# Altium schematic sheet 03.Sensing.SchDoc: ARES_R30_Power
size A4; CompanyName: HIGEN; DrawnBy: 212084; Revision: V0.21; SheetNumber: 3; SheetTotal: 5; DrawingNumber: 임시도면
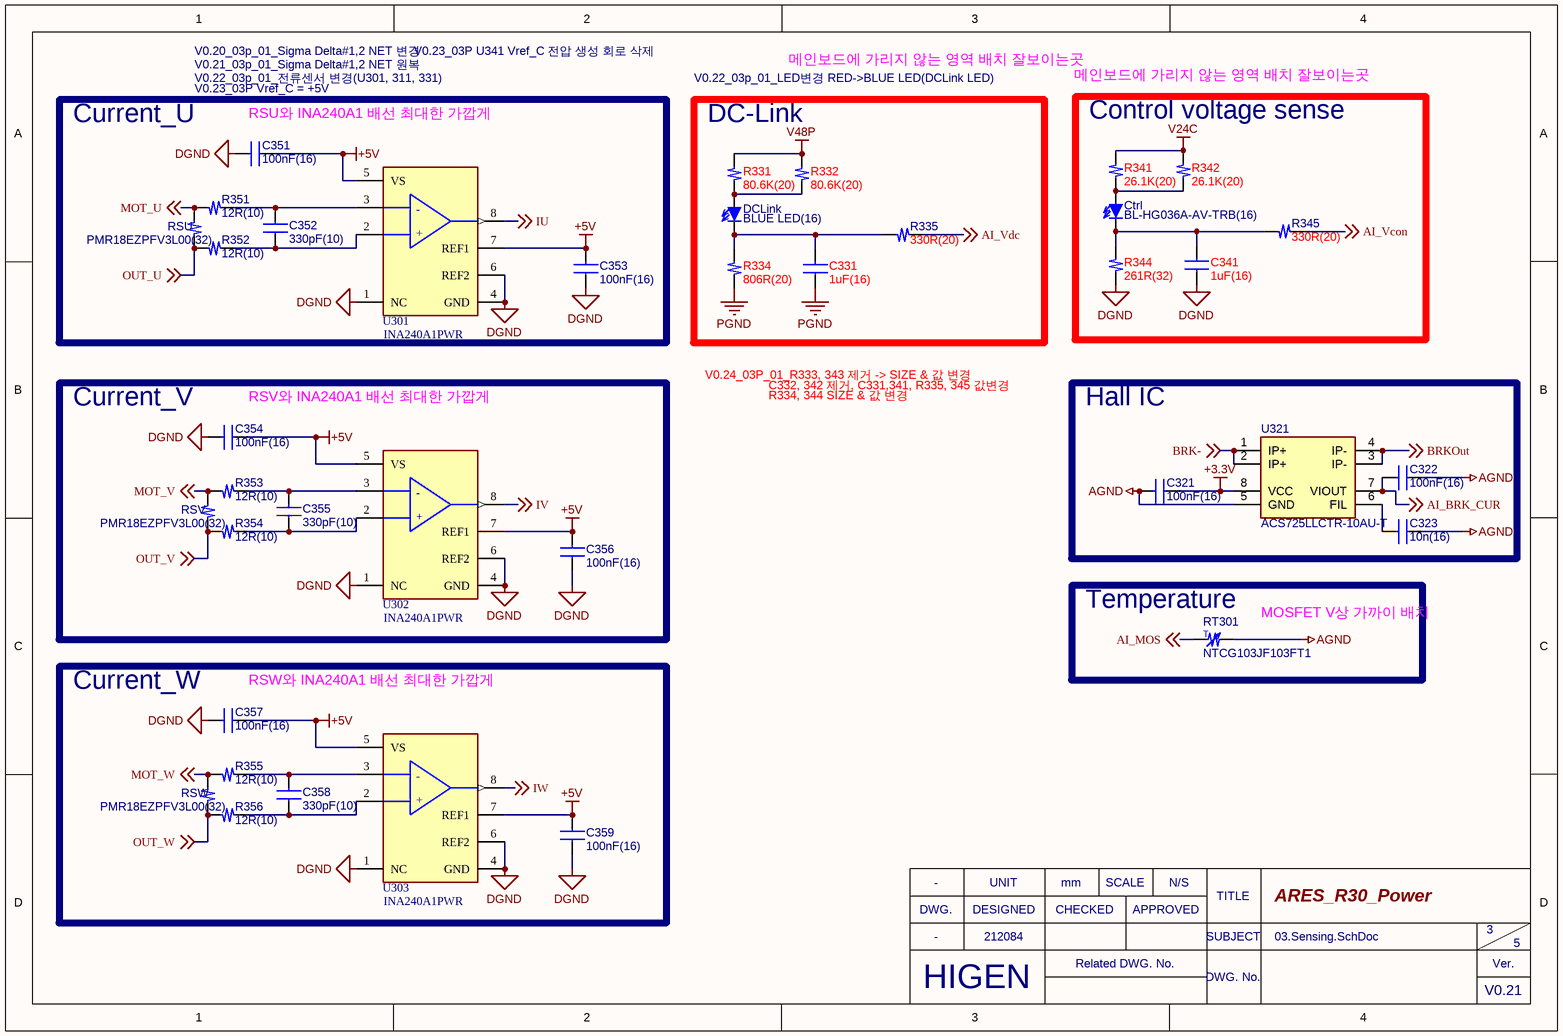
[diagram p0: 03.Sensing.SchDoc]

## Parts
C321  100nF(16)  [C-1608S]
C322  100nF(16)  [C-1608S]
C323  10n(16)  [C-1608S]
C331  1uF(16)  [C-1608S]
C341  1uF(16)  [C-1608S]
C351  100nF(16)  [C-1608S]
C352  330pF(10)  [C-1005S]
C353  100nF(16)  [C-1608]
C354  100nF(16)  [C-1608S]
C355  330pF(10)  [C-1005S]
C356  100nF(16)  [C-1608]
C357  100nF(16)  [C-1608S]
C358  330pF(10)  [C-1005S]
C359  100nF(16)  [C-1608]
Ctrl  BL-HG036A-AV-TRB(16)  [LED-1608-G]
DCLink  BLUE LED(16)  [LED-1608-B]
R331  80.6K(20)  [RES-2012]
R332  80.6K(20)  [RES-2012]
R334  806R(20)  [RES-2012]
R335  330R(20)  [RES-2012]
R341  26.1K(20)  [RES-2012]
R342  26.1K(20)  [RES-2012]
R344  261R(32)  [R-3216S]
R345  330R(20)  [RES-2012]
R351  12R(10)  [R-1005S]
R352  12R(10)  [R-1005S]
R353  12R(10)  [R-1005S]
R354  12R(10)  [R-1005S]
R355  12R(10)  [R-1005S]
R356  12R(10)  [R-1005S]
RSU  PMR18EZPFV3L00(32)  [R-5025]
RSV  PMR18EZPFV3L00(32)  [R-5025]
RSW  PMR18EZPFV3L00(32)  [R-5025]
RT301  NTCG103JF103FT1  [L-1005]
U301  INA240A1PWR  [TSSOP-8]
U302  INA240A1PWR  [TSSOP-8]
U303  INA240A1PWR  [TSSOP-8]
U321  ACS725LLCTR-10AU-T  [SO-8]

## Blocks framed on the sheet
Current_U: C351-C353 R351 R352 RSU U301
DC-Link: C331 DCLink R331 R332 R334 R335
Control voltage sense: C341 Ctrl R341 R342 R344 R345
Current_V: C354-C356 R353 R354 RSV U302
Hall IC: C321-C323 U321
Temperature: RT301
Current_W: C357-C359 R355 R356 RSW U303

## Nets
+3.3V: C321.2 U321.8(VCC)
+5V: C351.1 C353.1 C354.1 C356.1 C357.1 C359.1 U301.5(VS) U301.7(REF1) U302.5(VS) U302.7(REF1) U303.5(VS) U303.7(REF1)
AGND: C321.1 C322.2 C323.2 RT301.1 U321.5(GND)
DGND: C341.2 C351.2 C353.2 C354.2 C356.2 C357.2 C359.2 R344.2(P2) U301.1(NC) U301.4(GND) U301.6(REF2) U302.1(NC) U302.4(GND) U302.6(REF2) U303.1(NC) U303.4(GND) U303.6(REF2)
PGND: C331.2 R334.2(P2)
V24C: R341.1(P1) R342.1(P1)
V48P: R331.1(P1) R332.1(P1)
AI_BRK_CUR: C322.1 U321.7(VIOUT) ; off-sheet AI_BRK_CUR
AI_MOS: RT301.2 ; off-sheet AI_MOS
AI_Vcon: R345.2(P2) ; off-sheet AI_Vcon
AI_Vdc: R335.2(P2) ; off-sheet AI_Vdc
BRK-: U321.1(IP+) U321.2(IP+) ; off-sheet BRK-
BRKOut: U321.3(IP-) U321.4(IP-) ; off-sheet BRKOut
IU: U301.8(OUT) ; off-sheet IU
IV: U302.8(OUT) ; off-sheet IV
IW: U303.8(OUT) ; off-sheet IW
MOT_U: R351.1(P1) RSU.1(P1) ; off-sheet MOT_U
MOT_V: R353.1(P1) RSV.1(P1) ; off-sheet MOT_V
MOT_W: R355.1(P1) RSW.1(P1) ; off-sheet MOT_W
OUT_U: R352.1(P1) RSU.2(P2) ; off-sheet OUT_U
OUT_V: R354.1(P1) RSV.2(P2) ; off-sheet OUT_V
OUT_W: R356.1(P1) RSW.2(P2) ; off-sheet OUT_W
NetC323_1: C323.1 U321.6(FIL)
NetC331_1: C331.1 DCLink.2(Cathode) R334.1(P1) R335.1(P1)
NetC341_1: C341.1 Ctrl.2(Cathode) R344.1(P1) R345.1(P1)
NetC352_1: C352.1 R352.2(P2) U301.2(IN+)
NetC352_2: C352.2 R351.2(P2) U301.3(IN-)
NetC355_1: C355.1 R354.2(P2) U302.2(IN+)
NetC355_2: C355.2 R353.2(P2) U302.3(IN-)
NetC358_1: C358.1 R356.2(P2) U303.2(IN+)
NetC358_2: C358.2 R355.2(P2) U303.3(IN-)
NetCtrl_1: Ctrl.1(Anode) R341.2(P2) R342.2(P2)
NetDCLink_1: DCLink.1(Anode) R331.2(P2) R332.2(P2)

## Notes on the sheet
- V0.20_03p_01_Sigma Delta#1,2 NET 변경
- V0.21_03p_01_Sigma Delta#1,2 NET 원복
- V0.22_03p_01_전류센서 변경(U301, 311, 331)
- V0.23_03P Vref_C = +5V
- (near C351) RSU와 INA240A1 배선 최대한 가깝게
- V0.23_03P U341 Vref_C 전압 생성 회로 삭제
- V0.22_03p_01_LED변경 RED->BLUE LED(DCLink LED)
- 메인보드에 가리지 않는 영역 배치 잘보이는곳
- V0.24_03P_01_R333, 343 제거 -> SIZE & 값 변경
- (near C354) RSV와 INA240A1 배선 최대한 가깝게
- R334, 344 SIZE & 값 변경
- C332, 342 제거, C331,341, R335, 345 값변경
- (near RT301) MOSFET V상 가까이 배치
- (near C357) RSW와 INA240A1 배선 최대한 가깝게
- -
- DWG.
- UNIT
- DESIGNED
- mm
- CHECKED
- SCALE
- APPROVED
- N/S
- TITLE
- HIGEN
- Related DWG. No.
- SUBJECT
- DWG. No.
- Ver.
- (in symbol INA240A1PWR) -; +
- (in symbol Res_Thermal) T

## Library data of the parts
C321-C323 C331 C341 C351-C359 = CAP_NP
Ctrl DCLink = LED
R331 R332 R334 R335 R341 R342 R344 R345 R351-R356 RSU RSV RSW = Res
RT301 = Res_Thermal
U301-U303 = INA240A1PWR: IC CURR SENSE 1 CIRCUIT 8TSSOP; Manufacturer: Texas Instruments; Bandwidth: 400kHz; Input Bias Current: 90uA; Input Offset Voltage: 0.005mV; Max Junction Temp: +150°C; Max Supply Voltage: 5.5V; Min Supply Voltage: 2.7V; Nominal Supply Current: 1.8mA; Number Of Channels: 1; Standoff Height: 0.05mm; Verification Version: 0.0.0.3; Voltage Gain: 0.02V/mV; Datasheet Path: datasheets/IC_Texas_Instruments_INA240A1PWR_eec.pdf; Ambient Temperature Range High: +125°C; Ambient Temperature Range Low: -40°C; Automotive: No; ComponentLink1Description: Upverter; ComponentLink1URL: https://upverter.com/part/id/d93607e109c824dd/; ComponentLink2Description: Datasheet; ComponentLink2URL: http://www.ti.com/lit/ds/symlink/ina240.pdf; Digikey Description: IC CURR SENSE 1 CIRCUIT 8TSSOP; Digikey Part Number: 296-45088-1-ND; Height: 1.2mm; Ipc Land Pattern Name: SOP65P300X120-8; Lead Free: Yes; Mouser Part Number: 595-INA240A1PWR; Package: PW0008A; Part Number: INA240A1PWR; RoHS: TRUE; Supplier 1: Digi-Key; Supplier 2: Mouser; Supplier Part Number 1: 296-45088-1-ND; Supplier Part Number 2: 595-INA240A1PWR; Temperature: -40°C to +125°C; Temperature Range High: +125°C; Temperature Range Low: -40°C; helpURL: https://upverter.com/part/id/d93607e109c824dd/
U321 = ACS725LLCTR